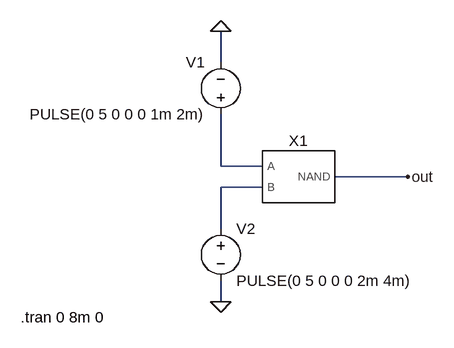
[diagram p0: schematic NAND_TB.asc]
NAND_TB.asc, the LTspice schematic file:
Version 4
SHEET 1 880 680
WIRE 112 0 112 -48
WIRE 112 160 112 80
WIRE 176 160 112 160
WIRE 400 176 288 176
WIRE 176 192 112 192
WIRE 112 256 112 192
WIRE 112 368 112 336
FLAG 400 176 out
FLAG 112 -48 0
FLAG 112 368 0
SYMBOL NAND 224 176 R0
SYMATTR InstName X1
SYMBOL voltage 112 96 R180
WINDOW 0 24 96 Left 2
WINDOW 3 24 16 Left 2
WINDOW 123 0 0 Left 0
WINDOW 39 0 0 Left 0
SYMATTR InstName V1
SYMATTR Value PULSE(0 5 0 0 0 1m 2m)
SYMBOL voltage 112 240 R0
WINDOW 123 0 0 Left 0
WINDOW 39 0 0 Left 0
SYMATTR InstName V2
SYMATTR Value PULSE(0 5 0 0 0 2m 4m)
TEXT -196 392 Left 2 !.tran 0 8m 0

The netlist it stands for:
* NAND_TB.asc
XX1 N001 N002 out NAND  ; pins A B NAND
V1 N001 0 PULSE(0 5 0 0 0 1m 2m)
V2 N002 0 PULSE(0 5 0 0 0 2m 4m)
.tran 0 8m 0
.backanno
.end